# Altium project esp_altimeter.PrjPCB
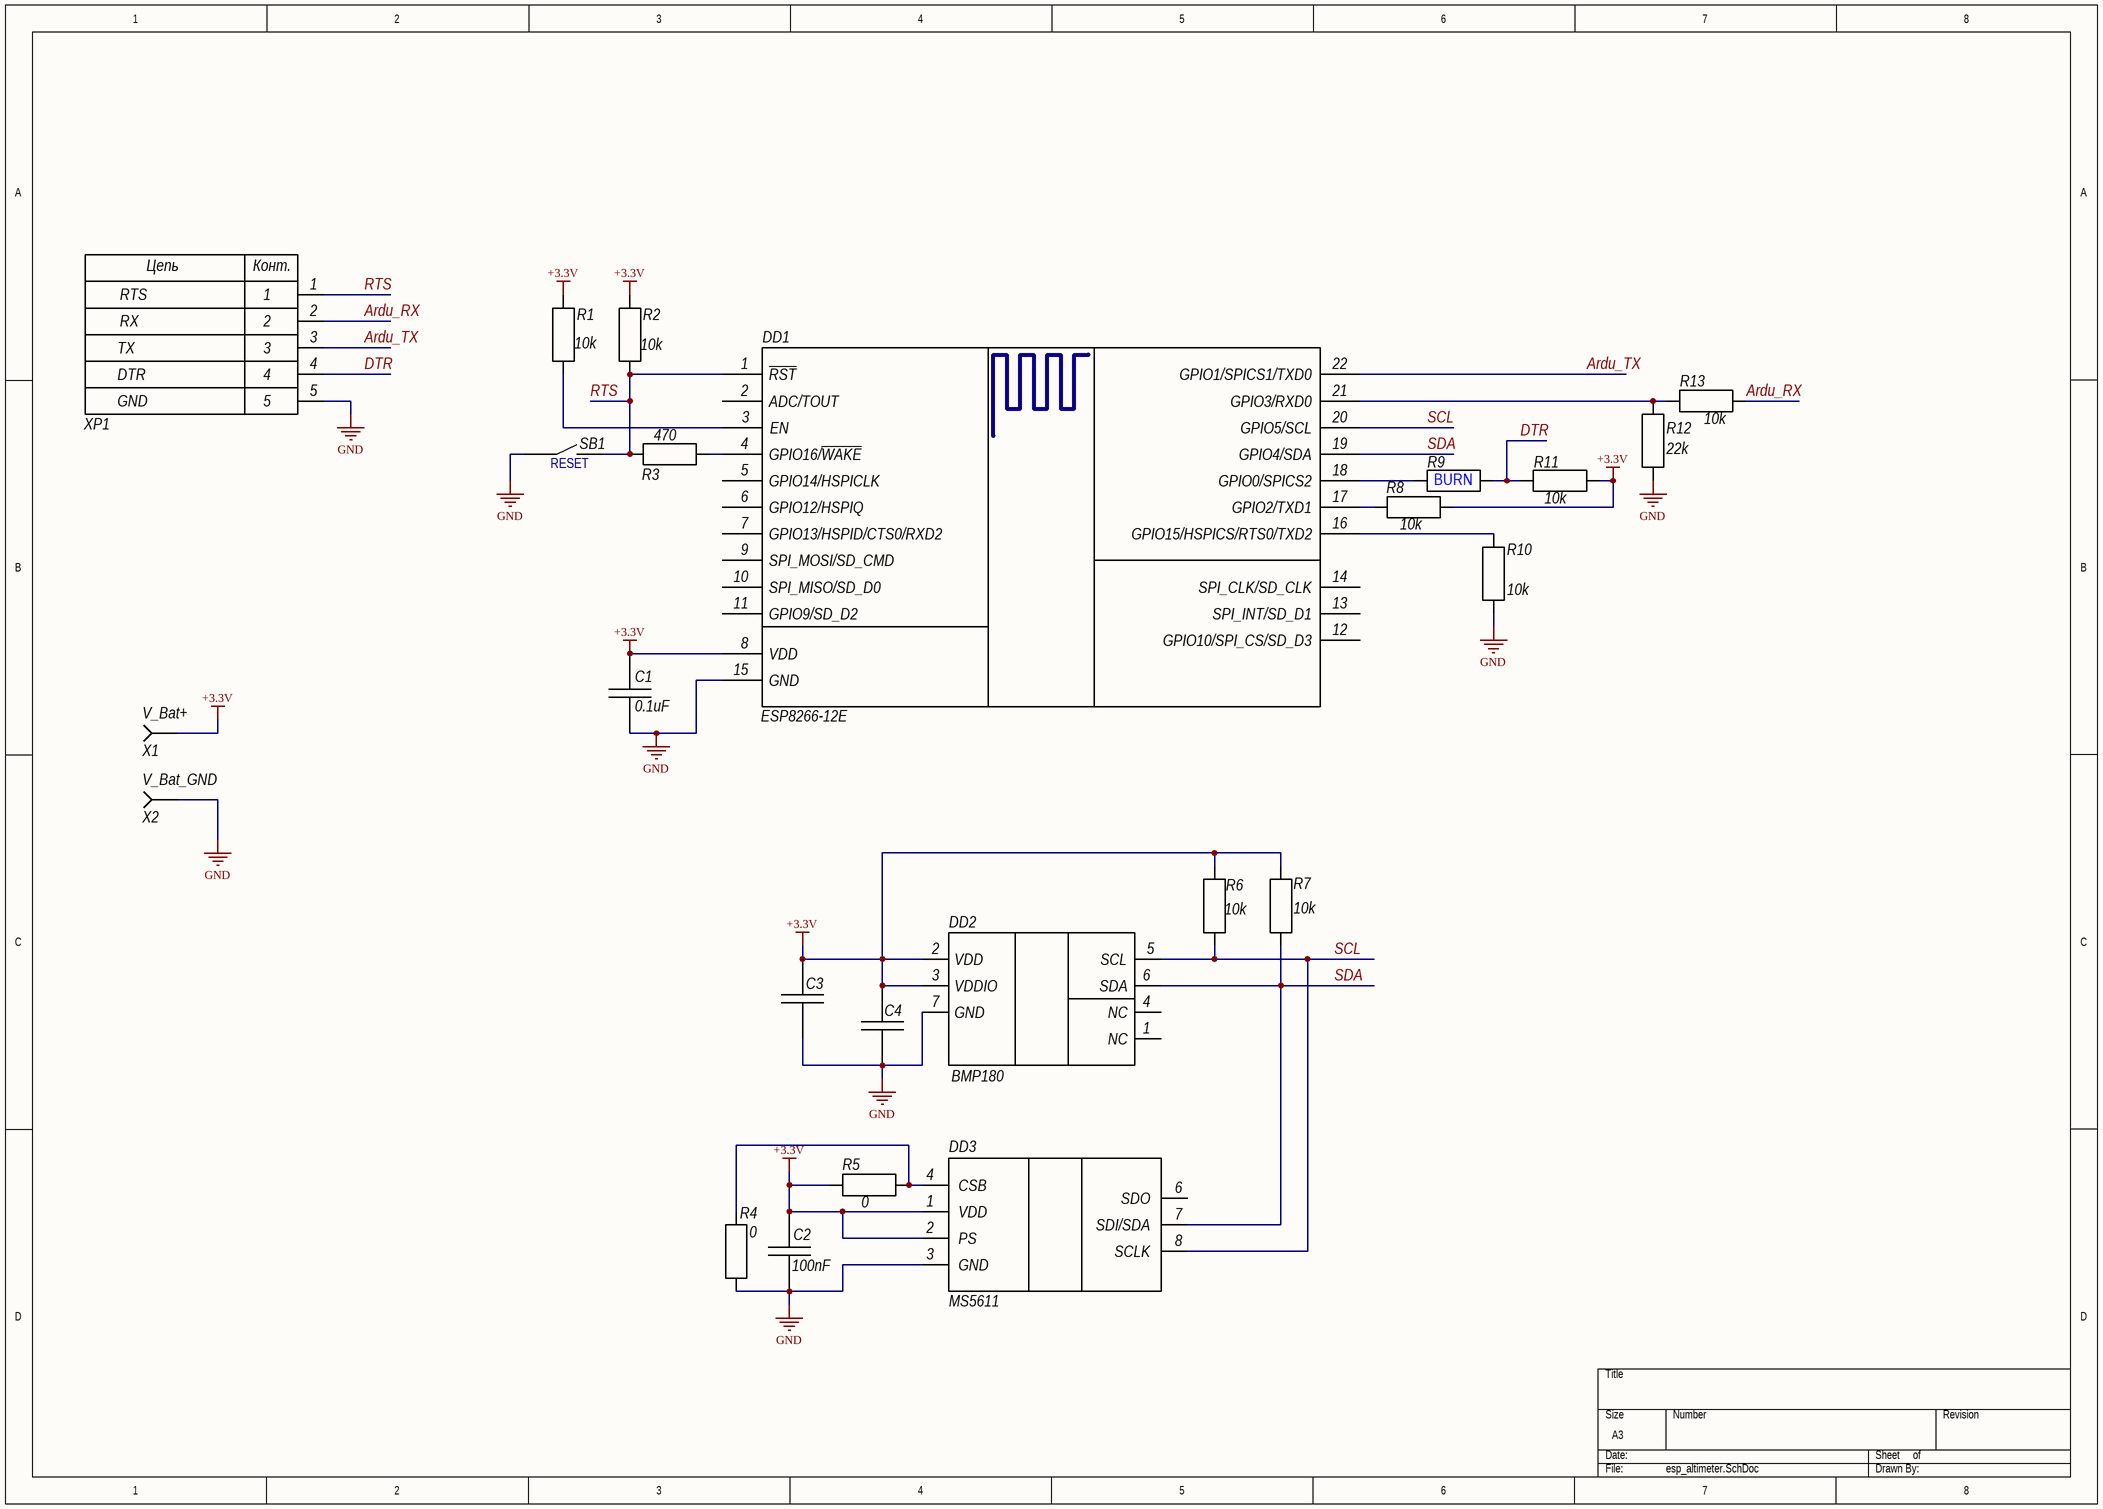
[diagram p0: esp_altimeter.SchDoc]
1 sheet, 24 parts. Net scope: global (net labels, ports and power ports of the same name join across sheets).
Board file: esp_altimeter_1.PcbDoc

## Sheet esp_altimeter.SchDoc
size A3

### Parts
C1  value 0.1uF  [CAP EIA 0603]  (hidden comment: Cap EIA 0603)
C2  value 100nF  [CAP EIA 0603]  (hidden comment: Cap EIA 0603)
C3  Cap EIA 0603  [CAP EIA 0603]  (value not drawn)
C4  Cap EIA 0603  [CAP EIA 0603]  (value not drawn)
DD1  ESP8266-12E  [ESP8266 ESP-12-E]
DD2  BMP180  [BMP180]
DD3  MS5611  [MS5611]
R1  value 10k  [RES EIA 0603]  (hidden comment: Res EIA 0603)
R2  value 10k  [RES EIA 0603]  (hidden comment: Res EIA 0603)
R3  value 470  [RES EIA 0603]  (hidden comment: Res EIA 0603)
R4  value 0  [RES EIA 0402]  (hidden comment: Res EIA 0402)
R5  value 0  [RES EIA 0402]  (hidden comment: Res EIA 0402)
R6  value 10k  [RES EIA 0603]  (hidden comment: Res EIA 0603)
R7  value 10k  [RES EIA 0603]  (hidden comment: Res EIA 0603)
R8  value 10k  [RES EIA 0603]  (hidden comment: Res EIA 0603)
R9  BURN  [RES EIA 0603]
R10  value 10k  [RES EIA 0603]  (hidden comment: Res EIA 0603)
R11  value 10k  [RES EIA 0603]  (hidden comment: Res EIA 0603)
R12  value 22k  [RES EIA 0603]  (hidden comment: Res EIA 0603)
R13  value 10k  [RES EIA 0603]  (hidden comment: Res EIA 0603)
SB1  RESET  [SB_Connector]
X1  V_Bat+  [Pin - Referal]  (no BOM)
X2  V_Bat_GND  [Pin - Referal]  (no BOM)
XP1  BM05B-SRSS-TB  [BM05B-SRSS-TB]  (value not drawn)

### Nets
+3.3V: C1.2 C2.2 C3.2 C4.2 DD1.8(VDD) DD2.2(VDD) DD2.3(VDDIO) DD3.1(VDD) DD3.2(PS) R1.2 R2.2 R5.2 R6.2 R7.2 R8.2 R11.2 X1.1
GND: C1.1 C2.1 C3.1 C4.1 DD1.15(GND) DD2.7(GND) DD3.3(GND) R4.1 R10.1 R12.1 SB1.1 X2.1 XP1.5
Ardu_RX: R13.2 XP1.2
Ardu_TX: DD1.22(GPIO1/SPICS1/TXD0) XP1.3
DTR: R9.2 R11.1 XP1.4
RTS: DD1.1(~{RST}) R2.1 R3.1 SB1.2 XP1.1
SCL: DD1.20(GPIO5/SCL) DD2.5(SCL) DD3.8(SCLK) R6.1
SDA: DD1.19(GPIO4/SDA) DD2.6(SDA) DD3.7(SDI/SDA) R7.1
NetDD1_3: DD1.3(EN) R1.1
NetDD1_4: DD1.4(GPIO16/~{WAKE}) R3.2
NetDD1_16: DD1.16(GPIO15/HSPICS/RTS0/TXD2) R10.2
NetDD1_17: DD1.17(GPIO2/TXD1) R8.1
NetDD1_18: DD1.18(GPIO0/SPICS2) R9.1
NetDD1_21: DD1.21(GPIO3/RXD0) R12.2 R13.1
NetDD3_4: DD3.4(CSB) R4.2 R5.1

Not connected (* = marked no-connect by the designer): DD1 2(ADC/TOUT) 5(GPIO14/HSPICLK) 6(GPIO12/HSPIQ) 7(GPIO13/HSPID/CTS0/RXD2) 9(SPI_MOSI/SD_CMD) 10(SPI_MISO/SD_D0) 11(GPIO9/SD_D2) 12(GPIO10/SPI_CS/SD_D3) 13(SPI_INT/SD_D1) 14(SPI_CLK/SD_CLK); DD2 1(NC) 4(NC); DD3 5(CSB) 6(SDO)

### Notes on the sheet
- RTS
- TX
- DTR
- RX
- GND
- (in symbol BM05B-SRSS-TB) Цепь; Конт.

### Library data of the parts
C1-C4 = Cap EIA 0603: Group: Конденсаторы; Manufacturer: *; Name: *; Supplier: *
  C3 C4: Value: *
DD1 = ESP8266 ESP-12E-RU
DD2 = BMP180: Manufacturer: Bosch; Group: Микросхемы; Name: BMP180; Supplier: www.elsin.ru; Value: *
R1-R3 R6-R13 = Res EIA 0603: Group: Резисторы; Manufacturer: *; Name: *; Supplier: *
  R9: Value: *
R4 R5 = Res EIA 0402: Group: Резисторы; Manufacturer: *; Name: *; Supplier: *
SB1 = SB_STM_Type: Manufacturer: A_Gorbunov; Group: Разъемы; Value: Соединительная площадка
X1 X2 = Pin_Referal: Generic Pin Contact; Value: Generic Pin Contact Referal; Group: -; Manufacturer: -; Name: -; Supplier: -
XP1 = BM05B-SRSS-TB: 5-Pin Angle Connector; Manufacturer: JST; Group: Разъемы; Value: Разъем штыревой 5-и контактный угловой; Name: BM05B-SRSS-TB; Supplier: ООО"Компэл"